# EAGLE design naranjino-radio-shield (EAGLE 5.07)
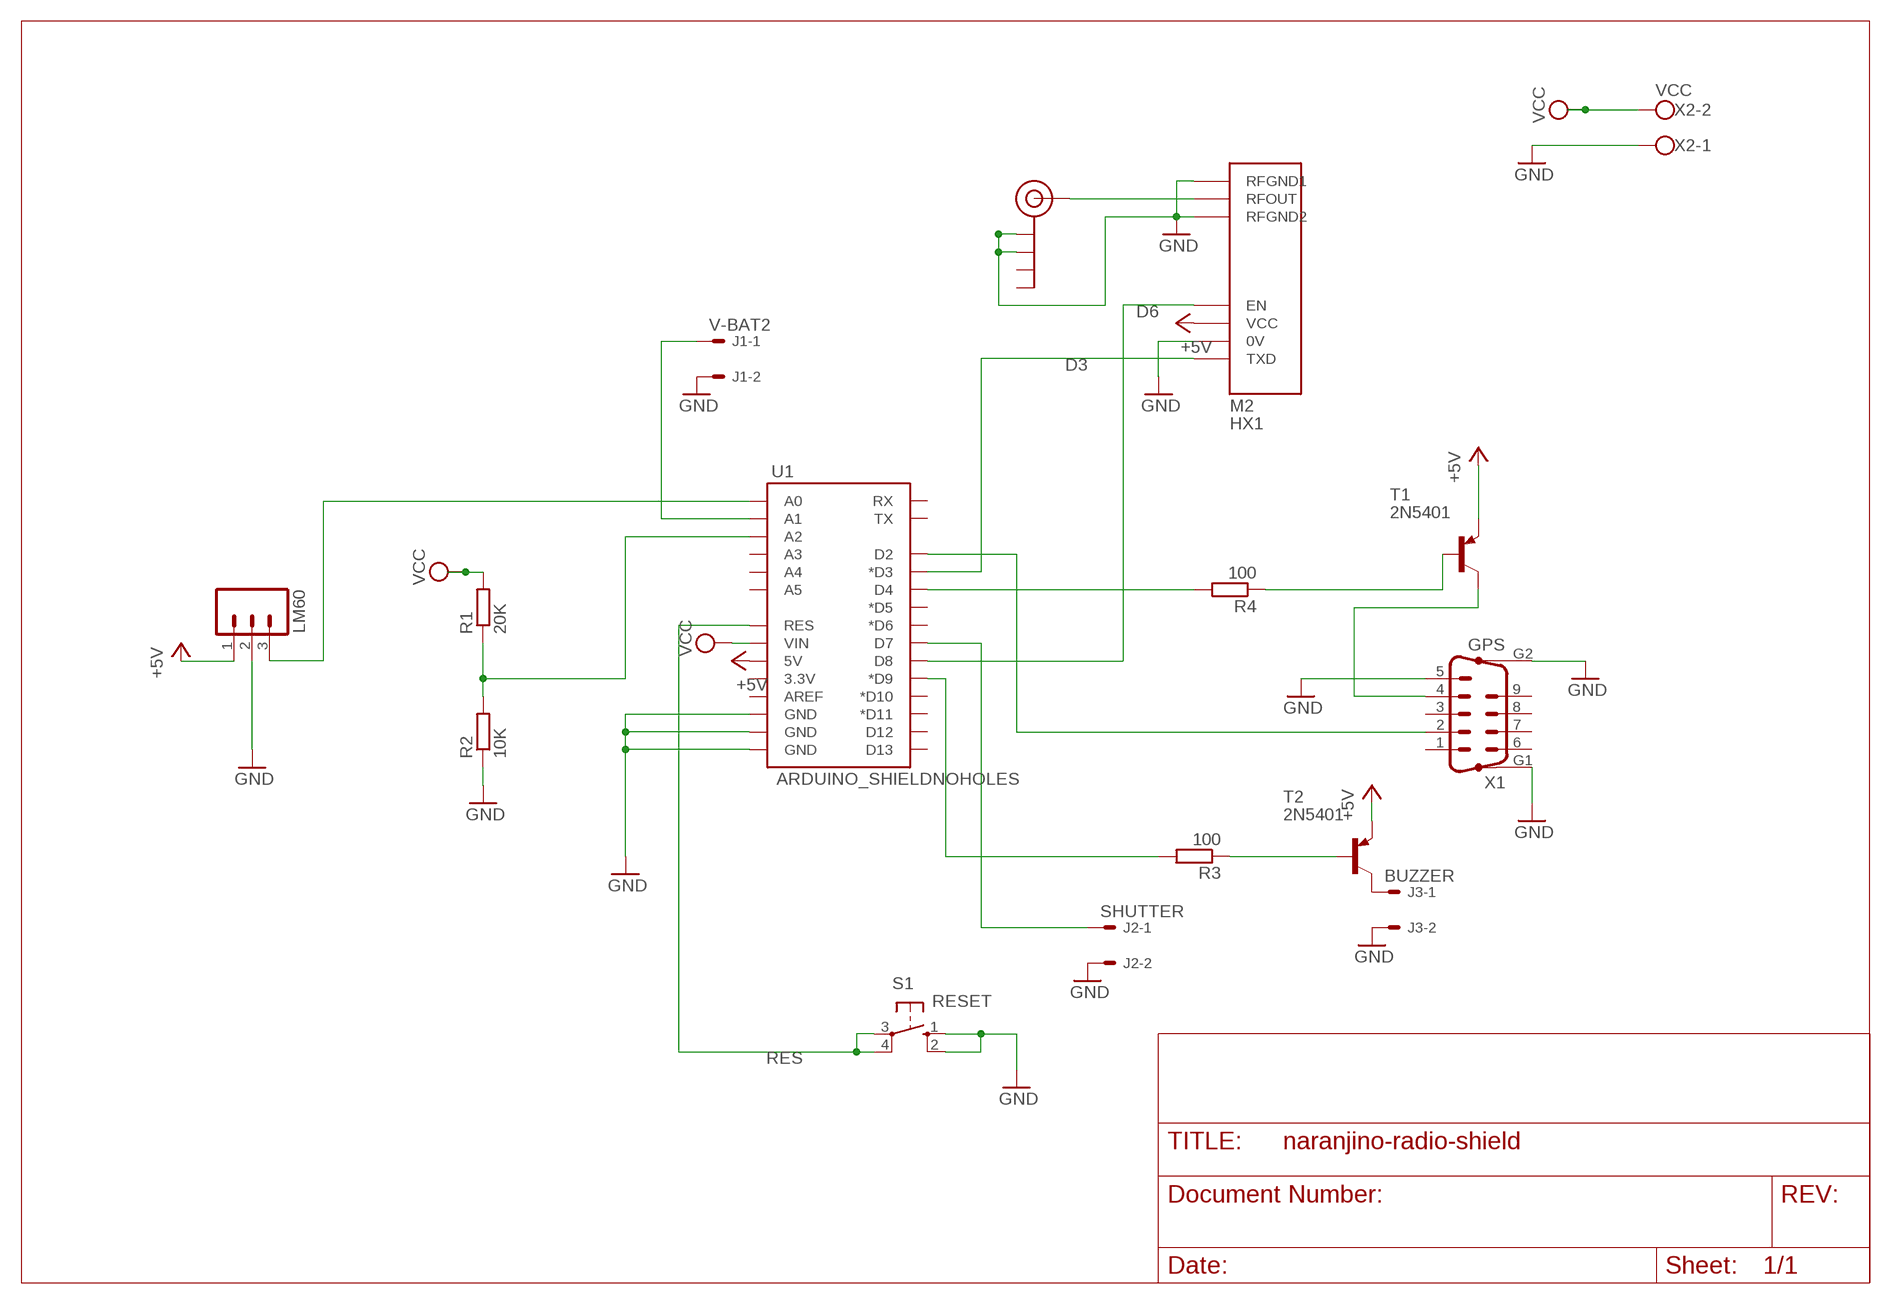
[diagram p0: schematic, sheet 1]

## Parts
J1  V-BAT2  22-27-2021-02  [6410-02]
J2  SHUTTER  22-27-2021-02  [6410-02]
J3  BUZZER  22-27-2021-02  [6410-02]
J$1  SMA_EDGE  [SMA-EDGE]
LM60  M03PTH  [1X03]
M2  HX1  [HX1]
R1  20K  R-EU_0207/10  [0207/10]
R2  10K  R-EU_0207/10  [0207/10]
R3  100  R-EU_0207/10  [0207/10]
R4  100  R-EU_0207/10  [0207/10]
S1  RESET  10-XX  [B3F-10XX]
T1  2N5401  -PNP-TO92  [TO92]
T2  2N5401  -PNP-TO92  [TO92]
U1  ARDUINO_SHIELDNOHOLES  [DUEMILANOVE_SHIELD_NOHOLES]
X1  GPS  M09HP  [M09HP]
X2  VCC  W237-102  [W237-102]

## Nets
+5V: LM60.1 M2.VCC T1.1(E) T2.1(E) U1.5V
A0: R1.1 R2.2 U1.A2
A1: LM60.3 U1.A0
D3: M2.TXD U1.D3(*D3)
D6: M2.EN U1.D8
D7: R4.2 U1.D4
D8: R3.2 U1.D9(*D9)
GND: J1.2 J2.2 J3.2 J$1.GND@0(GND) J$1.GND@1(GND) LM60.2 M2.0V M2.RFGND1 M2.RFGND2 R2.1 S1.1(S) S1.2(S1) U1.GND@0(GND) U1.GND@1(GND) U1.GND@2(GND) X1.5 X1.G1 X1.G2 X2.1
N$1: R4.1 T1.2(B)
N$2: J$1.SIG(SIGNAL) M2.RFOUT
N$3: J2.1 U1.D7
N$4: T1.3(C) X1.4
N$5: J1.1 U1.A1
N$7: R3.1 T2.2(B)
N$9: J3.1 T2.3(C)
RES: S1.3(P) S1.4(P1) U1.RES
RX: U1.D2 X1.2
VCC: R1.2 U1.VIN X2.2
Unconnected: J$1.GND@2(GND) J$1.GND@3(GND) U1.3.3V U1.A3 U1.A4 U1.A5 U1.AREF U1.D5(*D5) U1.D6(*D6) U1.D10(*D10) U1.D11(*D11) U1.D12 U1.D13 U1.RX U1.TX X1.1 X1.3 X1.6 X1.7 X1.8 X1.9

## Library data of the parts
J1-J3 = con-molex:22-?-02: CONNECTOR wire to board 2.54 mm (.1 inch) pitch header
J$1 = SparkFun:SMA_EDGE: SMA Antenna Connector End launch SMA connector. The paste layer has been removed so that the connector can be hand soldered onto the board after reflow.
LM60 = SparkFun:M03: Header 3 Standard 3-pin 0.1" header. Use with straight break away headers (SKU : PRT-00116), right angle break away headers (PRT-00553), swiss pins (PRT-00743), machine pins (PRT-00117), and female headers (PRT-00115). Molex polarized connector foot print use with SKU : PRT-08232 with associated crimp pins and housings.
M2 = trackuino:HX1
R1-R4 = rcl:R-EU_: RESISTOR, European symbol
S1 = switch-omron:10-XX: OMRON SWITCH
T1 T2 = transistor:*-PNP-: PNP Transistror
U1 = SparkFun:ARDUINO_SHIELD
X1 = con-subd:M09HP: SUB-D
X2 = con-wago-500:W237-102: WAGO SCREW CLAMP

## Net classes
0 10: width 0.254 mm
1 15: width 0.381 mm
2 20: width 0.508 mm
3 30: width 0.762 mm
4 40: width 1.016 mm
5 50: width 1.27 mm
6 HIGH Current: width 2.54 mm

## Board
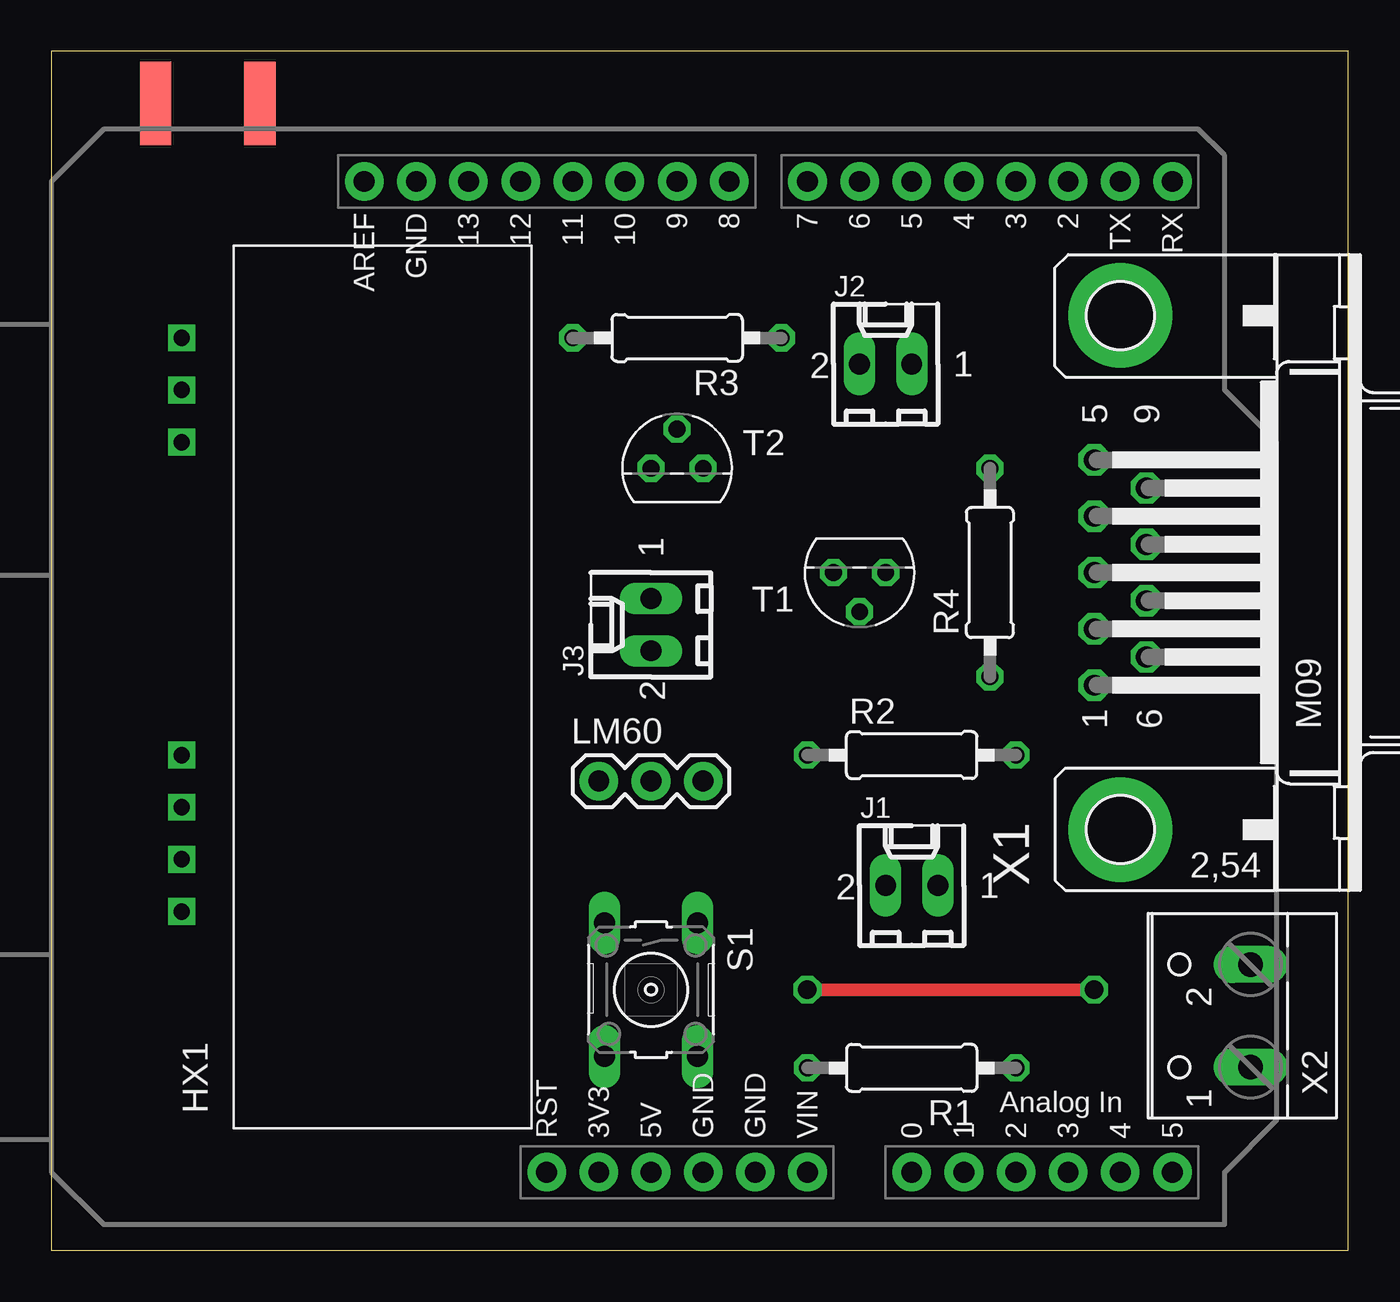
[diagram p1: board, top side]
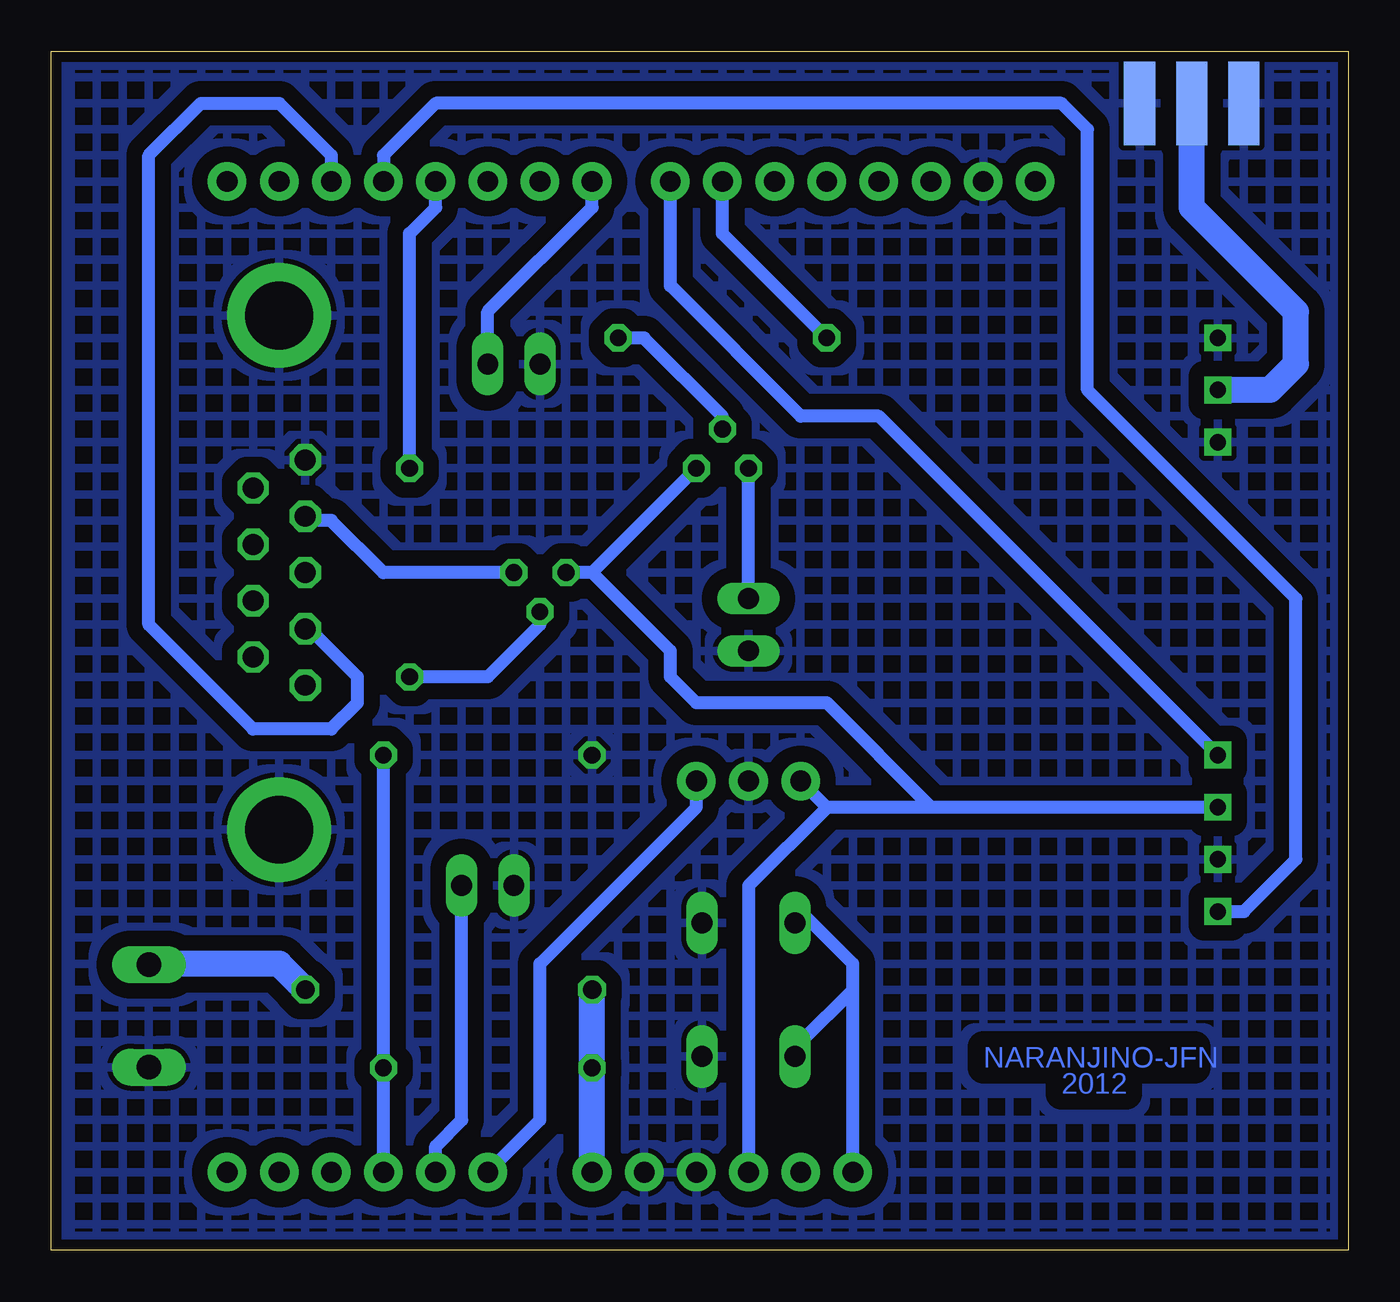
[diagram p2: board, bottom side, seen from below]

Size 63.17 x 58.41 mm. Coordinates in mm from the lower left corner, seen from the top.
Outline: 0,0 63.17,0 63.17,58.41 0,58.41 0,0
Copper layers (1*16): Top 0.035mm / dielectric 1.5mm / Bottom 0.035mm
Design rules "default *": minimum track width 25mil, minimum drill 24mil, track to track 30mil, track to pad 30mil, pad to pad 8mil, via to via 8mil, smd to smd 8mil, copper to edge 20mil, drill to drill 8mil, minimum pad ring 10mil, minimum via ring 8mil, stop-mask expansion 4mil, vias tented up to drill 0mil, thermal gap 10mil

### Footprints (pad centres in the part's own frame; a part is rotated, then mirrored left to right if it is on the bottom)
6410-02 = drill 1.016 long: 1 1.27,0; 2 -1.27,0
SMA-EDGE = smd 1.524 x 4.064: GND@0 0,0; GND@1 5.08,0; SIG 2.54,0 | smd 1.524 x 4.064 bottom: GND@2 0,0; GND@3 5.08,0
1X03 = drill 1.016 pad 1.88 round: 1 0,0; 2 2.54,0; 3 5.08,0
HX1 = drill 0.8 square: 0V 25.4,-8.89; EN 20.32,-8.89; RFGND1 0,-8.89; RFGND2 5.08,-8.89; RFOUT 2.54,-8.89; TXD 27.94,-8.89; VCC 22.86,-8.89
0207/10 = drill 0.813 octagon: 1 -5.08,0; 2 5.08,0
B3F-10XX = drill 1.016 long: 1 -3.251,2.261; 2 3.251,2.261; 3 -3.251,-2.261; 4 3.251,-2.261
TO92 = drill 0.813 octagon: 1 1.27,0; 2 0,1.905; 3 -1.27,0
DUEMILANOVE_SHIELD_NOHOLES = drill 1.016 pad 1.88 round: 3.3V 50.8,26.67; 5V 50.8,29.21; A0 50.8,41.91; A1 50.8,44.45; A2 50.8,46.99; A3 50.8,49.53; A4 50.8,52.07; A5 50.8,54.61; AREF 2.54,15.24; D2 2.54,49.53; D3 2.54,46.99; D4 2.54,44.45; D5 2.54,41.91; D6 2.54,39.37; D7 2.54,36.83; D8 2.54,33.02; D9 2.54,30.48; D10 2.54,27.94; D11 2.54,25.4; D12 2.54,22.86; D13 2.54,20.32; GND@0 50.8,31.75; GND@1 50.8,34.29; GND@2 2.54,17.78; RES 50.8,24.13; RX 2.54,54.61; TX 2.54,52.07; VIN 50.8,36.83
M09HP = drill 1.016 octagon: 1 -5.486,1.27; 2 -2.743,1.27; 3 0,1.27; 4 2.743,1.27; 5 5.486,1.27; 6 -4.115,-1.27; 7 -1.372,-1.27; 8 1.372,-1.27; 9 4.115,-1.27 | drill 3.302 pad 5.08 round: G1 -12.522,0; G2 12.522,0
W237-102 = drill 1.194 long: 1 -2.5,-1.27; 2 2.5,-1.27

### Placement (x,y rotation side)
J1  41.91,17.78 0 top
J2  40.64,43.18 0 top
J3  29.21,30.48 90 top
J$1  10.16,55.88 0 bottom
LM60  26.67,22.86 0 top
M2  15.24,44.45 270 top
R1  41.91,8.89 180 top
R2  41.91,24.13 0 top
R3  30.48,44.45 180 top
R4  45.72,33.02 90 top
S1  29.21,12.7 270 top
T1  39.37,33.02 180 top
T2  30.48,38.1 0 top
U1  0,54.61 270 top
X1  52.07,33.02 90 top
X2  57.15,11.43 90 top

### Tracks (layer width: path | path; a pad name or v marks a point on that pad's centre or on a via)
+5V
  Bottom 0.635: 36.83,33.02 T2.1 | 36.83,33.02 T1.1 | 20.32,21.59 25.4,21.59 | M2.VCC 20.32,21.59 | 25.4,21.59 LM60.1 | U1.5V 29.21,17.78 25.4,21.59 | 36.83,33.02 33.02,29.21 33.02,27.94 31.75,26.67 25.4,26.67 20.32,21.59
A0
  Bottom 0.635: R2.2 R1.1 U1.A2
A1
  Bottom 0.635: U1.A0 39.37,6.35 39.37,13.97 31.75,21.59 LM60.3
D3
  Bottom 0.635: M2.TXD 5.08,16.51 2.54,19.05 2.54,31.75 12.7,41.91 12.7,54.61 13.97,55.88 44.45,55.88 46.99,53.34 U1.D3
D6
  Bottom 0.635: M2.EN 22.86,40.64 26.67,40.64 33.02,46.99 U1.D8
D7
  Bottom 0.635: R4.2 45.72,49.53 44.45,50.8 U1.D4
D8
  Bottom 0.635: R3.2 30.48,49.53 U1.D9
GND
  pour Bottom (hatched): 0,58.42 63.5,58.42 63.5,0 0,0
N$1
  Bottom 0.635: R4.1 41.91,27.94 39.37,30.48 T1.2
N$2
  Bottom 1.27: M2.RFOUT 3.81,41.91 2.54,43.18 2.54,45.72 7.62,50.8 J$1.SIG
N$3
  Bottom 0.635: J2.1 41.91,45.72 36.83,50.8 U1.D7
N$4
  Bottom 0.635: T1.3 46.99,33.02 49.53,35.56 50.8,35.56 X1.4
N$5
  Bottom 0.635: J1.1 43.18,6.35 44.45,5.08 U1.A1
N$7
  Bottom 0.635: R3.1 34.29,44.45 30.48,40.64 T2.2
N$9
  Bottom 0.635: J3.1 T2.3
RES
  Bottom 0.635: 24.13,12.7 26.67,10.16 S1.4 | 24.13,12.7 24.13,13.97 26.67,16.51 S1.3 | U1.RES 24.13,12.7
RX
  Bottom 0.635: U1.D2 49.53,53.34 52.07,55.88 55.88,55.88 58.42,53.34 58.42,30.48 53.34,25.4 49.53,25.4 48.26,26.67 48.26,27.94 50.8,30.48 X1.2
VCC  (via drill 0.9)
  Top 0.61: v36.83,12.7 v50.8,12.7
  Bottom 1.27: v36.83,12.7 R1.2 U1.VIN | v50.8,12.7 52.07,13.97 58.42,13.97 X2.2

### Text on the board
Bottom: NARANJINO-JFN | 2012